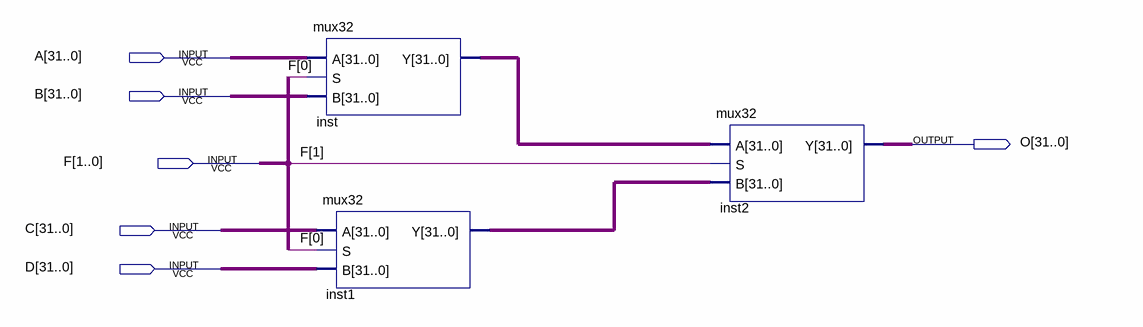
[diagram p0: schematic sheet]
// Quartus schematic fourinputmux32.bdf as structural Verilog: 3 symbols, 6 pins
module fourinputmux32 (
  input  [31:0] A,
  input  [31:0] B,
  input  [1:0] F,
  input  [31:0] C,
  input  [31:0] D,
  output [31:0] O
);

  wire [31:0] inst1_y, inst_y;

  mux32 inst (.A(A), .S(F[0]), .B(B), .Y(inst_y));
  mux32 inst1 (.A(C), .S(F[0]), .B(D), .Y(inst1_y));
  mux32 inst2 (.A(inst_y), .S(F[1]), .B(inst1_y), .Y(O));
endmodule
